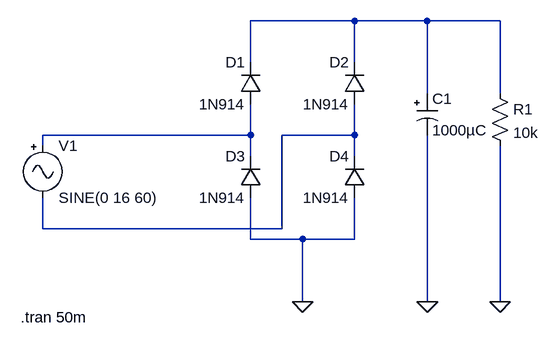
[diagram p0: schematic Ponte_Retificadora.asc]
Ponte_Retificadora.asc, the LTspice schematic file:
Version 4
SHEET 1 880 680
WIRE -48 -64 -208 -64
WIRE 64 -64 -48 -64
WIRE 176 -64 64 -64
WIRE -208 0 -208 -64
WIRE -48 0 -48 -64
WIRE 64 48 64 -64
WIRE 176 48 176 -64
WIRE -208 112 -208 64
WIRE -208 112 -528 112
WIRE -48 112 -48 64
WIRE -48 112 -160 112
WIRE -528 128 -528 112
WIRE -208 144 -208 112
WIRE -48 144 -48 112
WIRE -528 256 -528 208
WIRE -160 256 -160 112
WIRE -160 256 -528 256
WIRE -208 272 -208 208
WIRE -128 272 -208 272
WIRE -48 272 -48 208
WIRE -48 272 -128 272
WIRE -128 368 -128 272
WIRE 64 368 64 112
WIRE 176 368 176 128
FLAG -128 368 0
FLAG 176 368 0
FLAG 64 368 0
SYMBOL diode -192 64 R180
WINDOW 0 24 64 Left 2
WINDOW 3 24 0 Left 2
SYMATTR InstName D1
SYMATTR Value 1N914
SYMBOL diode -32 64 R180
WINDOW 0 24 64 Left 2
WINDOW 3 24 0 Left 2
SYMATTR InstName D2
SYMATTR Value 1N914
SYMBOL diode -192 208 R180
WINDOW 0 24 64 Left 2
WINDOW 3 24 0 Left 2
SYMATTR InstName D3
SYMATTR Value 1N914
SYMBOL diode -32 208 R180
WINDOW 0 24 64 Left 2
WINDOW 3 24 0 Left 2
SYMATTR InstName D4
SYMATTR Value 1N914
SYMBOL res 160 32 R0
SYMATTR InstName R1
SYMATTR Value 10k
SYMBOL Misc\\signal -528 112 R0
WINDOW 123 0 0 Left 0
WINDOW 39 0 0 Left 0
SYMATTR InstName V1
SYMATTR Value SINE(0 16 60)
SYMBOL polcap 48 48 R0
SYMATTR InstName C1
SYMATTR Value 1000µC
TEXT -562 392 Left 2 !.tran 50m

The netlist it stands for:
* Ponte_Retificadora.asc
D1 N002 N001 1N914
D2 N003 N001 1N914
D3 0 N002 1N914
D4 0 N003 1N914
R1 N001 0 10k
V1 N002 N003 SINE(0 16 60)
C1 N001 0 1000µC
.model D D
.lib standard.dio
.tran 50m
.backanno
.end